# EAGLE design ViaCar Sense V2 (EAGLE 5.10)
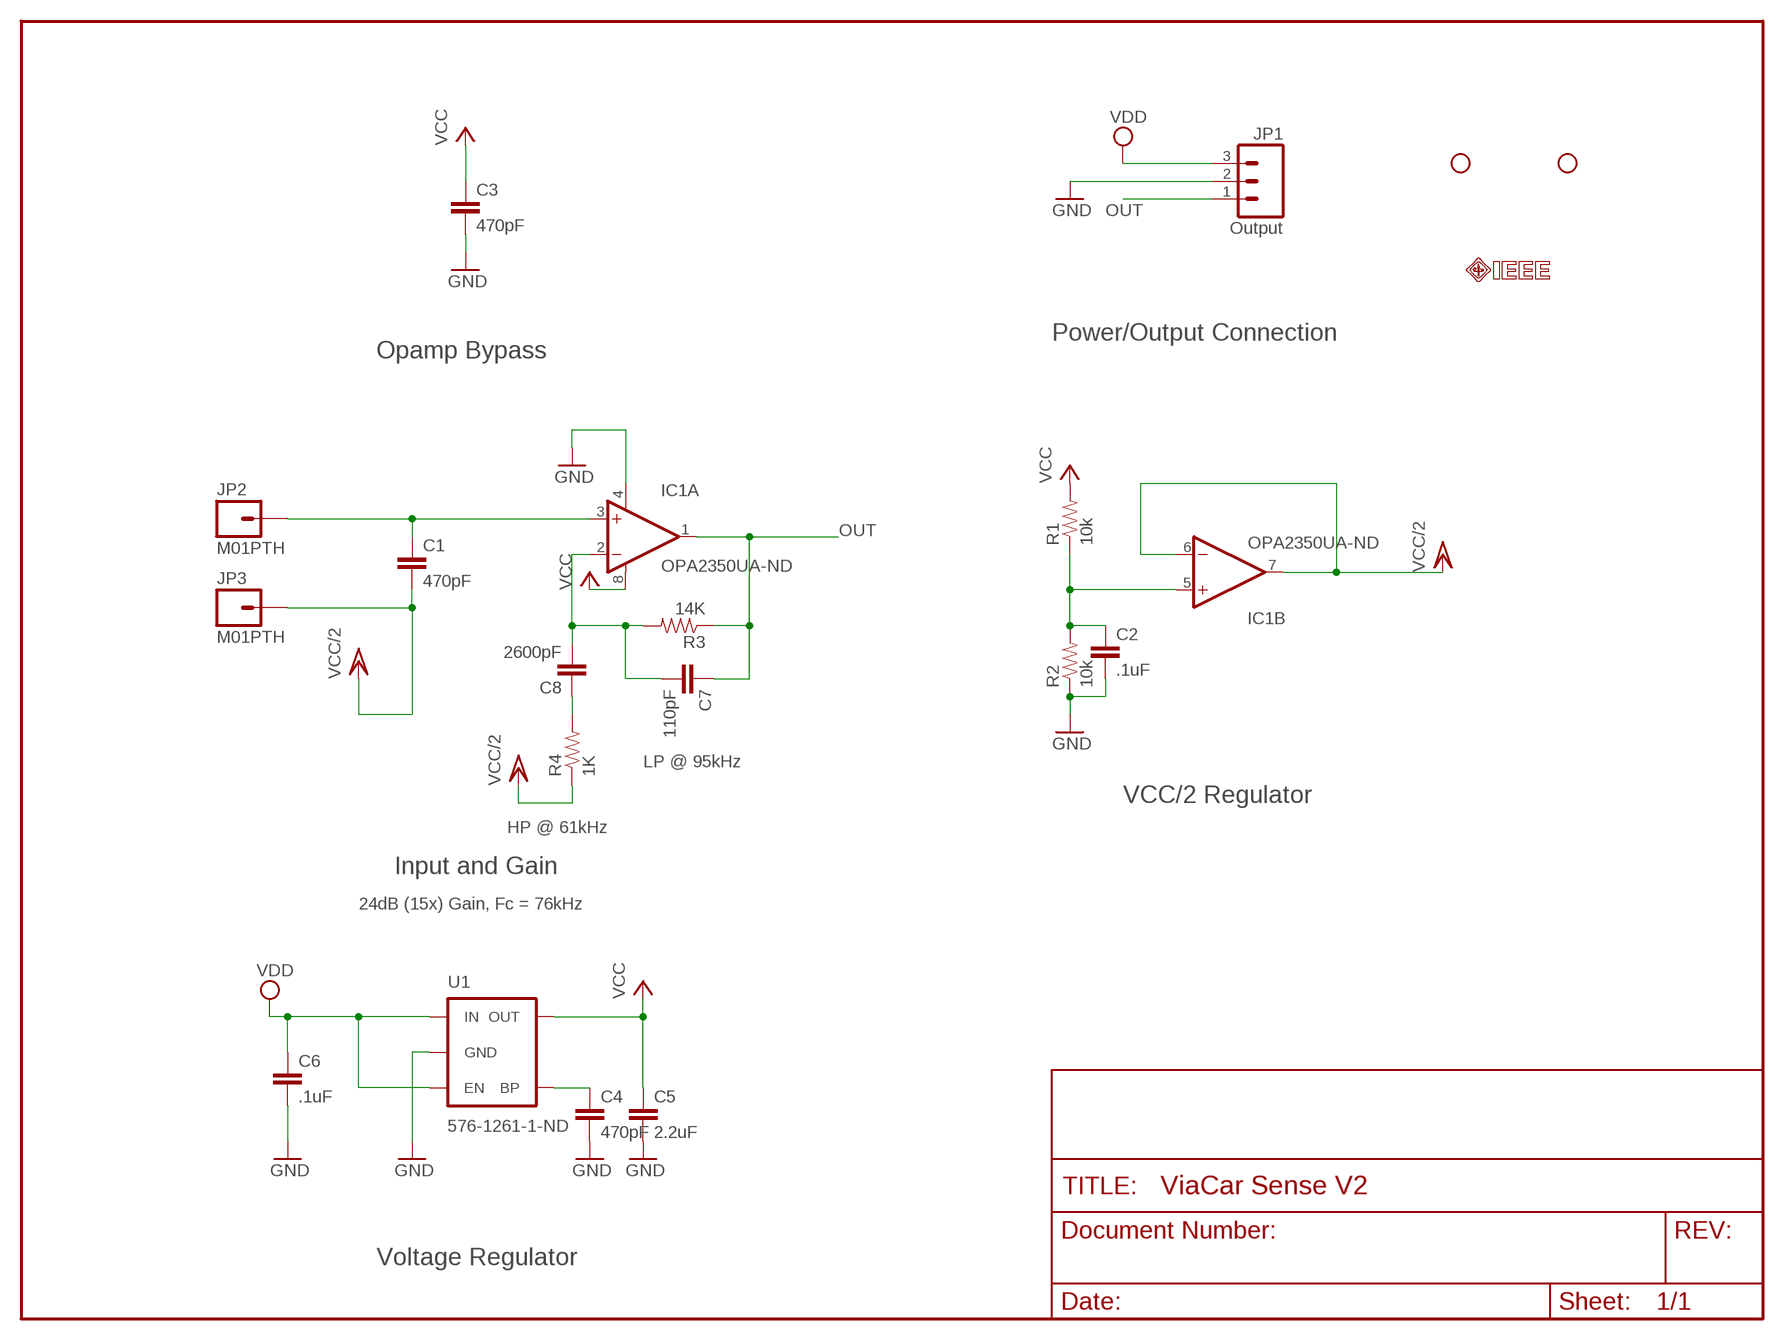
[diagram p0: schematic, sheet 1]

## Parts
C1  470pF  CAP0603-CAP  [0603-CAP]
C2  .1uF  CAP0603-CAP  [0603-CAP]
C3  470pF  CAP0603-CAP  [0603-CAP]
C4  470pF  CAP0603-CAP  [0603-CAP]
C5  2.2uF  CAP0603-CAP  [0603-CAP]
C6  .1uF  CAP0603-CAP  [0603-CAP]
C7  110pF  CAP0603-CAP  [0603-CAP]
C8  2600pF  CAP0603-CAP  [0603-CAP]
IC1  OPA2350UA-ND  OPAMP-DUALU  [SO08]
JP1  Output  M03POLAR  [MOLEX-1X3]
JP2  M01PTH  [1X01]
JP3  M01PTH  [1X01]
JP4  STAND-OFF  [STAND-OFF]
JP5  STAND-OFF  [STAND-OFF]
R1  10k  RESISTOR0603-RES  [0603-RES]
R2  10k  RESISTOR0603-RES  [0603-RES]
R3  14K  RESISTOR0603-RES  [0603-RES]
R4  1K  RESISTOR0603-RES  [0603-RES]
U1  576-1261-1-ND  V_REG_LDOSMD  [SOT23-5]

## Nets
GND: C2.2 C3.2 C4.2 C5.2 C6.2 IC1.4(A:V-) JP1.2 R2.1 U1.2(GND)
N$1: C1.1 IC1.3(A:+IN) JP2.1
N$2: C8.1 R4.2
N$3: C2.1 IC1.5(B:+IN) R1.1 R2.2
N$4: C7.2 C8.2 IC1.2(A:-IN) R3.2
N$5: C4.1 U1.4(BP)
OUT: C7.1 IC1.1(A:OUT) JP1.1 R3.1
VCC: C3.1 C5.1 IC1.8(A:V+) R1.2 U1.5(OUT)
VCC/2: C1.2 IC1.6(B:-IN) IC1.7(B:OUT) JP3.1 R4.1
VDD: C6.1 JP1.3 U1.1(IN) U1.3(EN)

## Notes on the sheet
- Power/Output Connection
- Opamp Bypass
- LP @ 95kHz
- VCC/2 Regulator
- HP @ 61kHz
- Input and Gain
- 24dB (15x) Gain, Fc = 76kHz
- Voltage Regulator

## Library data of the parts
C1-C8 = SparkFun:CAP: Capacitor Standard 0603 ceramic capacitor, and 0.1" leaded capacitor.
IC1 = SparkFun:OPAMP-DUAL: Operational Amplifier
JP1 = SparkFun:M03: Header 3 Standard 3-pin 0.1" header. Use with straight break away headers (SKU : PRT-00116), right angle break away headers (PRT-00553), swiss pins (PRT-00743), machine pins (PRT-00117), and female headers (PRT-00115). Molex polarized connector foot print use with SKU : PRT-08232 with associated crimp pins and housings.
JP2 JP3 = SparkFun:M01: Header 1 Standard 1-pin 0.1" header. Use with straight break away headers (SKU : PRT-00116), right angle break away headers (PRT-00553), swiss pins (PRT-00743), machine pins (PRT-00117), and female headers (PRT-00115).
JP4 JP5 = SparkFun:STAND-OFF: Stand Off This is the mechanical footprint for a #4 phillips button head screw. Use the keepout ring to avoid running the screw head into surrounding components. SKU : PRT-00447
R1-R4 = SparkFun:RESISTOR: Resistor Basic schematic elements and footprints for 0603, 1206, and PTH 1/10th watt (small) resistors.
U1 = SparkFun:V_REG_LDO: Voltage Regulator LDO Standard 150mA LDO voltage regulator in SOT-23 layout. Micrel part MIC5205. BP (by-pass) pin is used to lower output noise with 470pF cap.

## Board
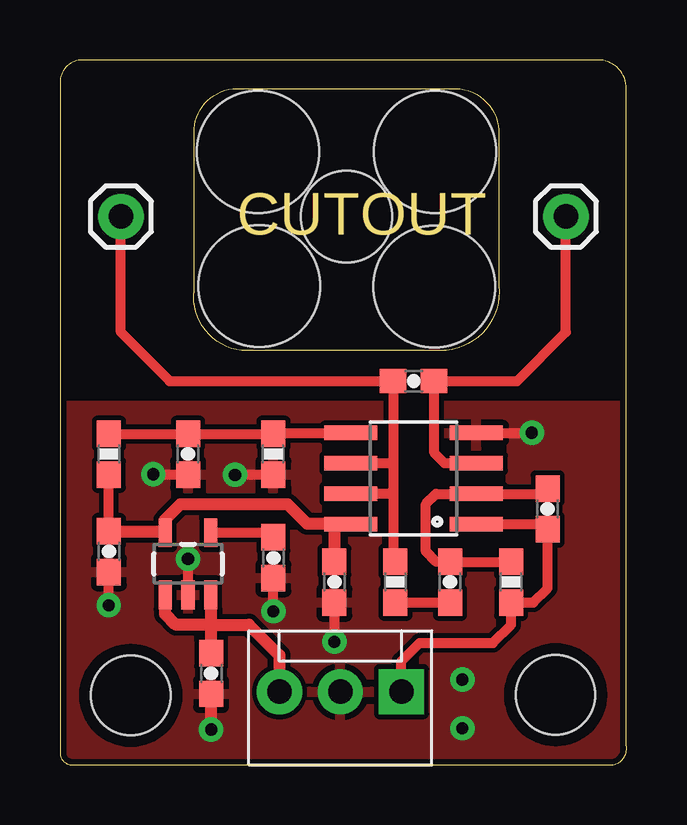
[diagram p1: board, top side]
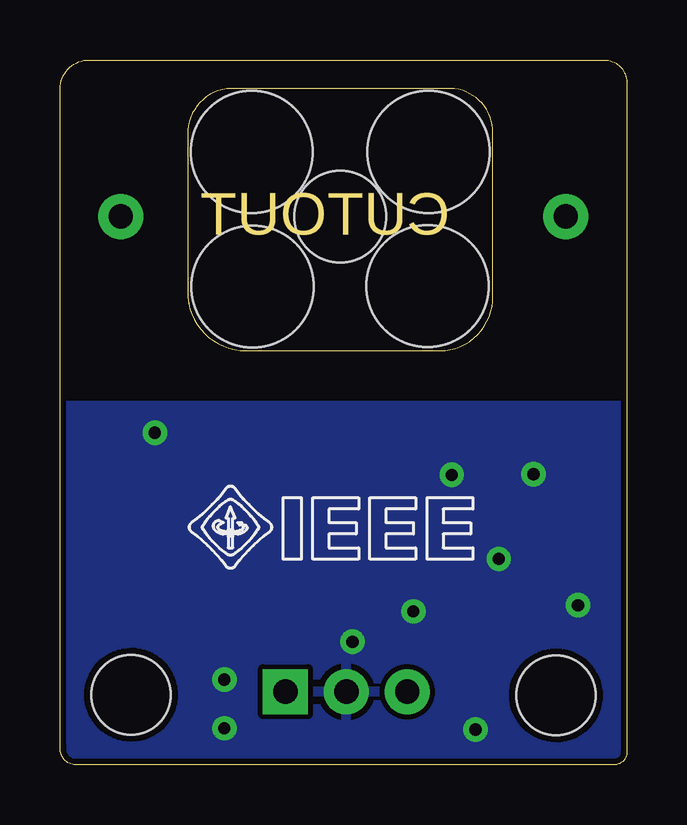
[diagram p2: board, bottom side, seen from below]

Size 23.61 x 29.39 mm. Coordinates in mm from the lower left corner, seen from the top.
Outline: 23.04,0 arc90 23.6,0.81 23.6,28.19 arc90 22.41,29.39 0.94,29.39 arc90 0,28.45 0,0.51 arc90 0.51,0 23.04,0
Outline: 7.57,17.27 arc-90 5.59,19.76 5.59,26.51 arc-90 7.52,28.19 16.3,28.19 arc-90 18.29,26.46 18.29,19.96 arc-90 16.1,17.27 7.57,17.27
Copper layers (1*16): Top 0.035mm / dielectric 1.5mm / Bottom 0.035mm
Design rules "SparkFun": minimum track width 8mil, minimum drill 20mil, track to track 8mil, track to pad 8mil, pad to pad 8mil, via to via 8mil, smd to smd 8mil, copper to edge 10mil, drill to drill 8mil, minimum pad ring 12mil, minimum via ring 10mil, stop-mask expansion 4mil, vias tented up to drill 25mil, thermal gap 10mil
Holes 5.08 mm at 8.31,19.96 15.6,19.94 8.26,25.55 15.62,25.55
Holes 3.81 mm at 11.94,22.86

### Footprints (pad centres in the part's own frame; a part is rotated, then mirrored left to right if it is on the bottom)
0603-CAP = smd 1.1 x 1: 1 -0.85,0; 2 0.85,0
SO08 = smd 0.61 x 2.21: 1 -1.905,-2.616; 2 -0.635,-2.616; 3 0.635,-2.616; 4 1.905,-2.616; 5 1.905,2.616; 6 0.635,2.616; 7 -0.635,2.616; 8 -1.905,2.616
MOLEX-1X3 = drill 1.016 pad 1.88 square: 1 0,0 | drill 1.016 pad 1.88 round: 2 2.54,0; 3 5.08,0
1X01 = drill 1.016 pad 1.88 round: 1 0,0
STAND-OFF = hole 3.302: 0,0
0603-RES = smd 1.1 x 1: 1 -0.85,0; 2 0.85,0
SOT23-5 = smd 0.55 x 1.2: 1 -0.95,-1.3; 2 0,-1.3; 3 0.95,-1.3; 4 0.95,1.3; 5 -0.95,1.3

### Placement (x,y rotation side)
C1  14.73,16 180 top
C2  5.33,12.95 270 top
C3  11.43,7.62 270 top
C4  8.89,8.64 270 top
C5  2.03,8.89 270 top
C6  6.3,3.81 270 top
C7  20.32,10.67 90 top
C8  16.26,7.62 90 top
IC1  14.73,11.94 90 top
JP1  14.22,3.05 180 top
JP2  21.08,22.86 0 top
JP3  2.54,22.86 0 top
JP4  2.95,2.9 0 top
JP5  20.65,2.92 0 top
R1  2.03,12.95 270 top
R2  8.89,12.95 90 top
R3  18.8,7.62 90 top
R4  13.97,7.62 270 top
U1  5.33,8.38 0 top
U$2  [IEEE-LOGO-2-SM]  16.51,9.91 0 bottom

### Tracks (layer width: path | path; a pad name or v marks a point on that pad's centre or on a via)
GND  (via drill 0.51)
  Top 0.406: v2.03,6.66 C5.2 | U1.2 v5.33,8.59 | v8.89,6.4 C4.2 | C3.2 v11.43,5.13 | IC1.4 v19.66,13.84 | C2.2 3.9,12.1 v3.89,12.12 | R2.1 7.38,12.1 v7.29,12.09
  Top 0.508: v6.3,1.47 C6.2
  other vias: 16.76,3.56 16.76,1.52
  pour Bottom: 0,0.25 23.62,0.25 23.62,14.99 0,14.99
  pour Top (isolate 0.203): 0,-0.25 0,14.99 23.62,14.99 23.62,-0.25
N$1
  Top 0.406: C1.1 19.05,16 21.08,18.03 JP2.1 | C1.1 15.24,15.84 | IC1.3 16.03,12.57 15.6,13.01 15.6,15.99 C1.1
N$2
  Top 0.406: R4.2 C8.1
N$3
  Top 0.406: R1.1 C2.1 R2.2 8.93,13.84 IC1.5
N$4
  Top 0.406: C7.2 20.61,11.3 IC1.2 15.67,11.3 15.24,10.87 15.24,8.89 15.66,8.47 C8.2 R3.2
N$5
  Top 0.406: U1.4 8.69,9.68 C4.1
OUT
  Top 0.406: IC1.1 20.61,10.03 C7.1 20.32,7.37 19.72,6.77 R3.1 18.8,5.84 18.03,5.08 14.99,5.08 14.22,4.32 JP1.1
VCC
  Top 0.406: C5.1 R1.2 | 4.33,9.74 U1.5 4.38,10.23 | C3.1 11.35,8.29
  Top 0.508: C5.1 4.33,9.74 | 4.38,10.23 5.03,10.87 9.47,10.87 10.29,10.06 11.43,10.06 | IC1.8 11.58,10.06 11.43,10.06 | 11.43,10.06 C3.1
VCC/2
  Top 0.406: JP3.1 2.54,18.03 4.57,16 C1.2 13.88,12.45 | 13.88,12.45 13.88,11.43 | 13.88,11.43 13.88,8.56 R4.1 | IC1.6 13.76,12.57 13.88,12.45 | IC1.7 13.76,11.3 13.88,11.43
VDD
  Top 0.406: U1.3 6.35,7.02 6.35,6.96 6.3,6.91
  Top 0.508: U1.1 4.38,6.28 4.83,5.84 6.3,5.84 | 6.3,5.84 7.87,5.84 9.14,4.57 JP1.3 | 6.3,5.84 6.3,6.91 | C6.1 6.3,5.84

### Text on the board
Dimension: CUTOUT
tValues: + | - | ~
bValues: + | - | ~